# EasyEDA Pro project 初版天猛星拓展板_2026-07-21.epro

# Schematic Schematic1
Assembly Variant: Basic; Board Name: Board1; Create Date: 2026-07-18; Page Name: P1; Project Name: 天猛星拓展板; Schematic Name: Schematic1; Update Date: 2026-07-18; BladeWidth: 10; Company: 嘉立创EDA; Page Size: A4; RegionStart: 1; ShowBorder: 1; TitleBlock: 1; TitleBlockPosition: 3; Version: V1.0; XRegionCount: 6; YRegionCount: 4
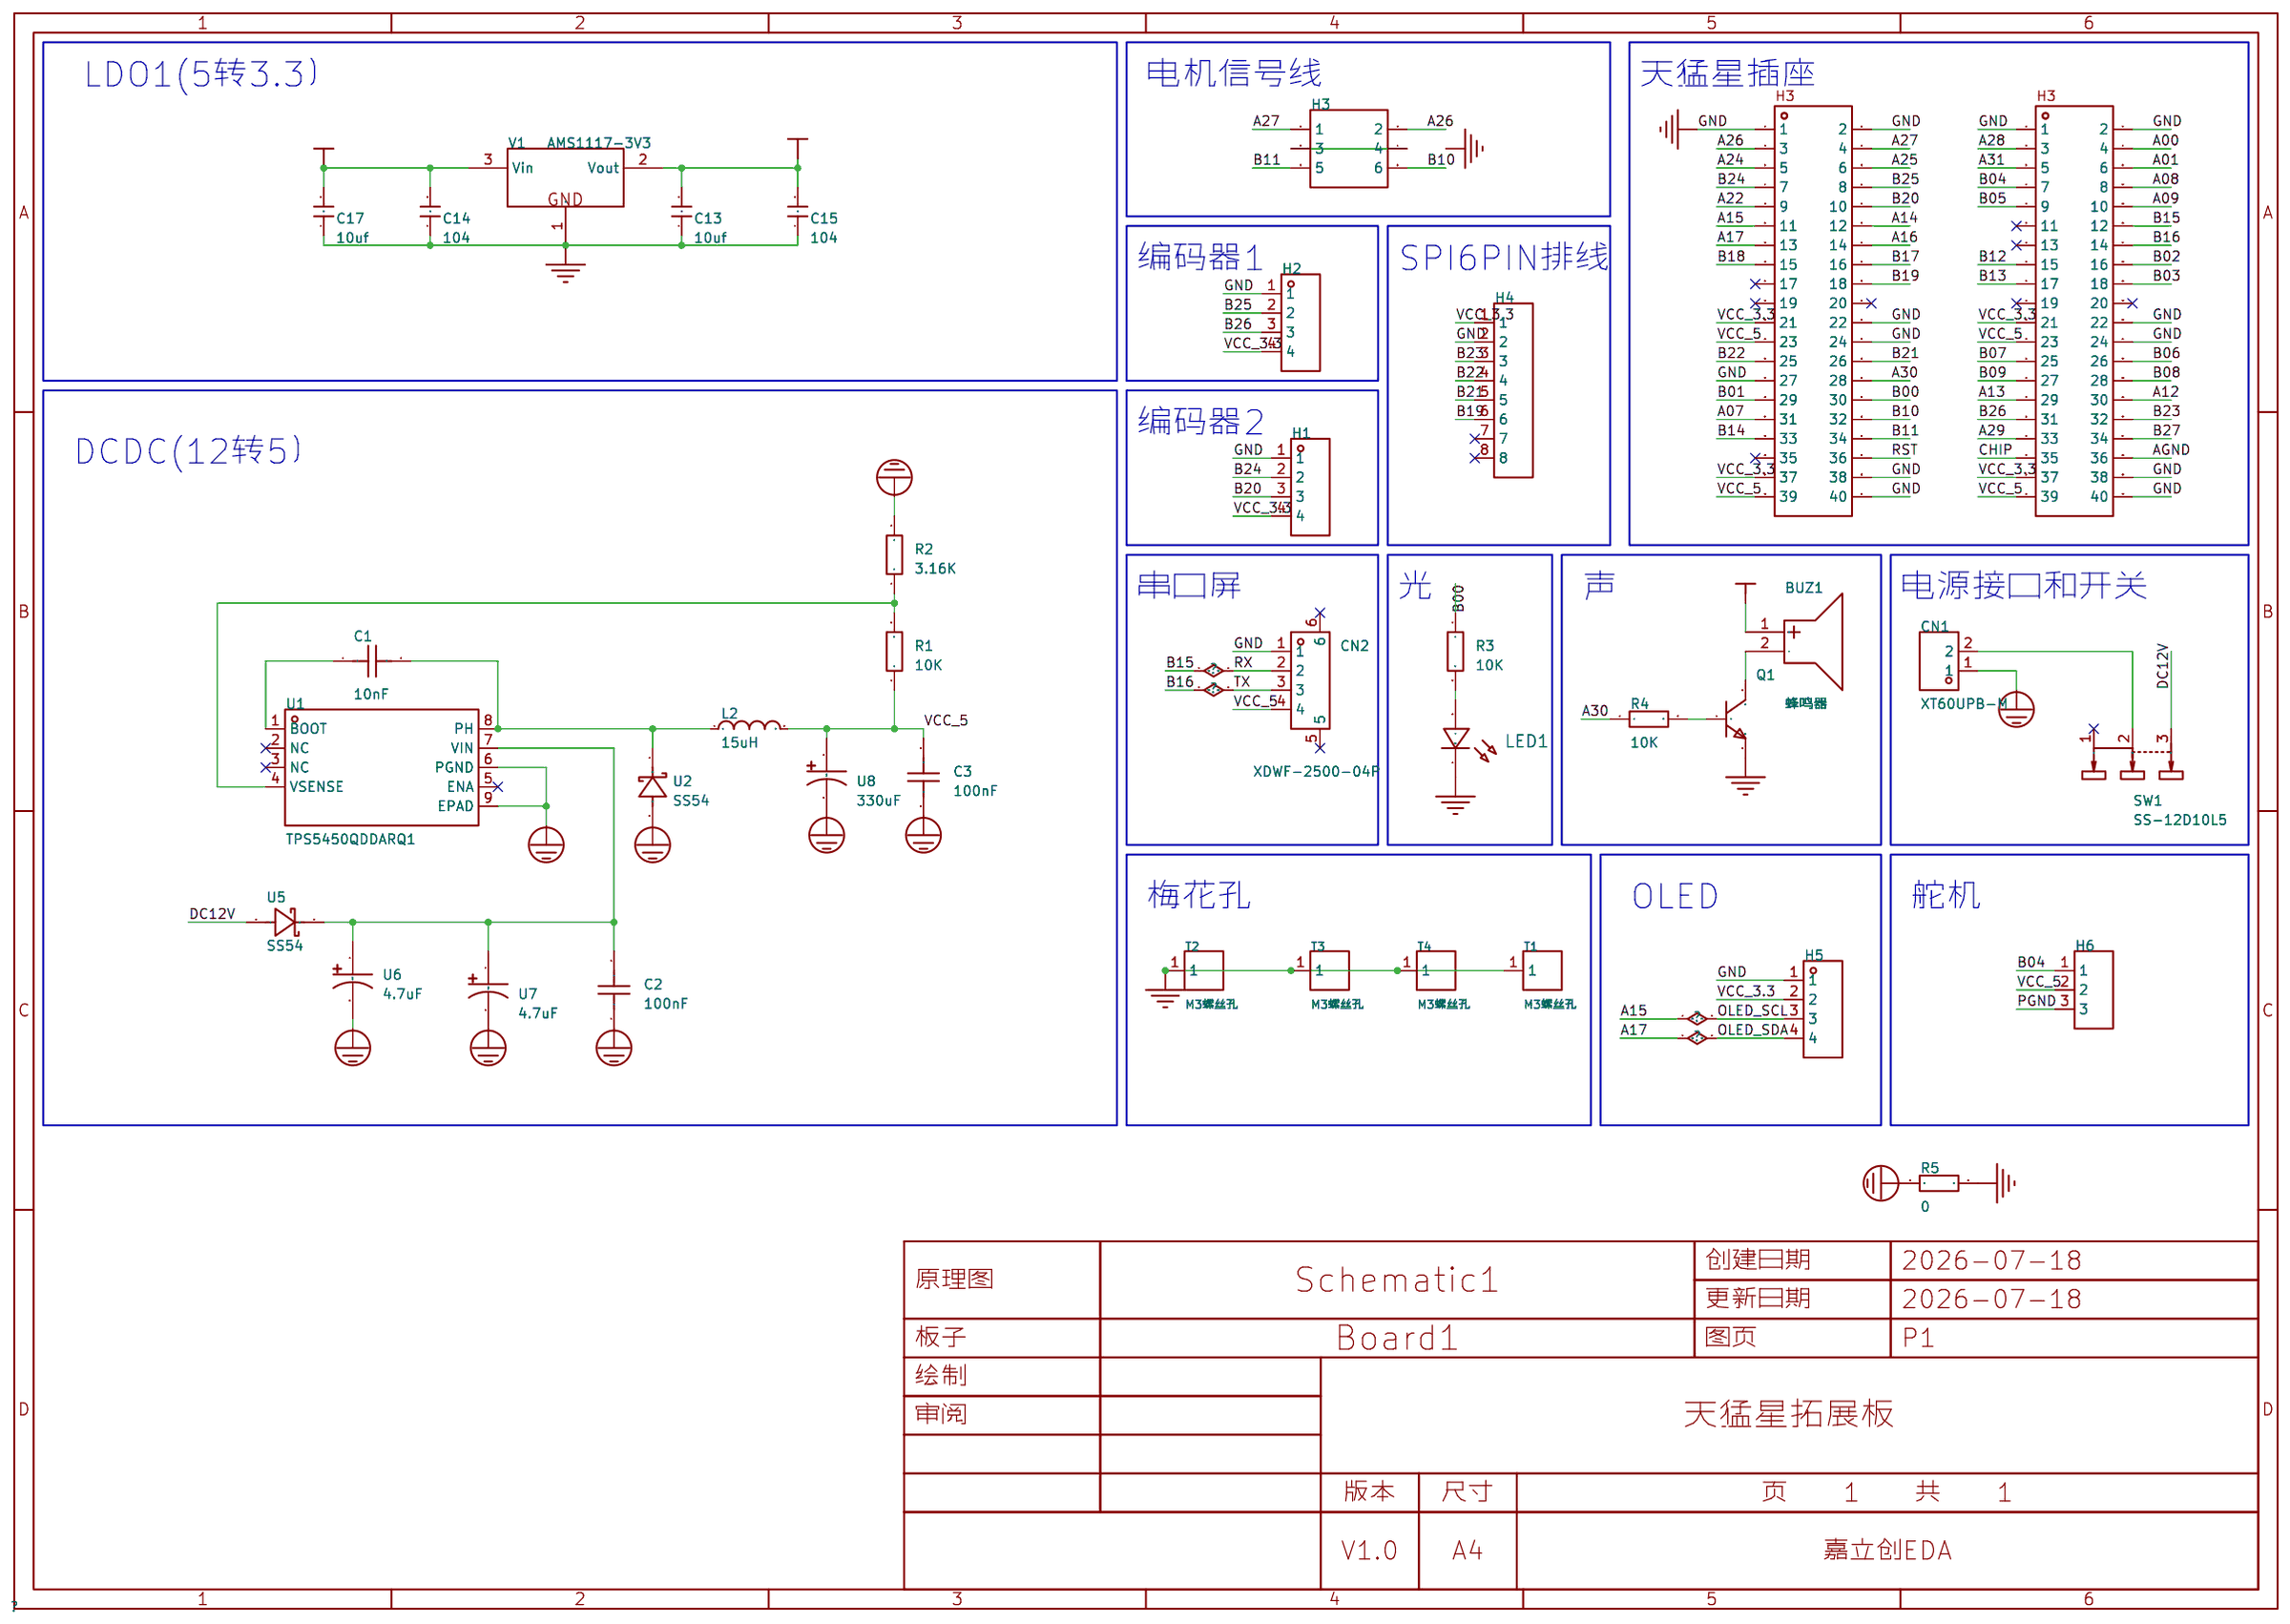
[diagram p0: schematic sheet]

## Parts
BUZ1  蜂鸣器  [BUZ-TH_BD9.0-P5.00-D0.6-FD]
C1  10nF  [C0603]
C2  100nF  [C0603]
C3  100nF  [C0603]
C13  10uf  [C 0805_M]
C14  104  [C 0603_M]
C15  104  [C 0603_M]
C17  10uf  [C 0805_M]
CN1  XT60UPB-M  [CONN-TH_XT60UPB-M]
CN2  XDWF-2500-04P  [CONN-SMD_4P-P2.54_MXXH-2.54-04P-WT1-0-A]
H1  -  [HDR-TH_4P-P2.54-V-F]
H2  -  [HDR-TH_4P-P2.54-V-F]
H3  -  [HDR-TH_6P-P2.54-V-R2-C3-S2.54_A2541WV-2X3P]
H4  -  [HDR-TH_8P-P2.54-V-F-1]
H5  -  [HDR-TH_4P-P2.54-V-F]
H6  -  [HDR-TH_3P-P2.54-V-F]
L2  15uH  [IND-SMD_L7.3-W6.6]
LED1  -  [LED_0603]
Q1  -  [S8050_SOT-23]
R1  10K  [R0603]
R2  3.16K  [R0603]
R3  10K  [R0603]
R4  10K  [R0603]
R5  0  [R0603]
SW1  SS-12D10L5  [SW-TH_SS-12D10L5]
T1  M3螺丝孔  [M3梅花孔]
T2  M3螺丝孔  [M3梅花孔]
T3  M3螺丝孔  [M3梅花孔]
T4  M3螺丝孔  [M3梅花孔]
U1  TPS5450QDDARQ1  [SOIC-8_L4.9-W3.9-P1.27-LS6.0-BL-EP]
U2  SS54  [SMA_L4.2-W2.6-LS5.1-RD]
U3  -  [HDR-TH_40P-P2.54-V-F-R2-C20-S2.54]
U4  -  [HDR-TH_40P-P2.54-V-F-R2-C20-S2.54]
U5  SS54  [SMA_L4.2-W2.6-LS5.1-RD]
U6  4.7uF  [CAP-SMD_BD5.0-L5.3-W5.3-FD]
U7  4.7uF  [CAP-SMD_BD5.0-L5.3-W5.3-FD]
U8  330uF  [CAP-SMD_BD5.0-L5.3-W5.3-FD]
V1  AMS1117-3V3  [SOT223_L]

## Library data of the parts
BUZ1 = 蜂鸣器: Supplier Part: C9900020875; Supplier Footprint: 插件; JLCPCB Part Class: Extended Part; Supplier: LCSC
C1-C3 = CAP_0603: Supplier Footprint: 0603
C13 C17 = 10uf: 无极性贴片电容; BOM名称: 无极性贴片电容; 版权归属: 源创客; 学习资源: www.ooocke.com; Origin Footprint 2: C 0201; Origin Footprint 3: C 0402; Origin Footprint 4: C 0603; Origin Footprint 5: C 1206; Origin Footprint 6: C 1210; Origin Footprint 7: C 1808; Origin Footprint 8: C 1812; Origin Footprint 9: C 1825; Origin Footprint 10: C 2225; Design Item ID: C; Library Name: 电阻-电容-电感
C14 C15 = 104: 无极性贴片电容; BOM名称: 无极性贴片电容; 版权归属: 源创客; 学习资源: www.ooocke.com; Origin Footprint 2: C 0201; Origin Footprint 3: C 0402; Origin Footprint 4: C 0805_M; Origin Footprint 5: C 1206; Origin Footprint 6: C 1210; Origin Footprint 7: C 1808; Origin Footprint 8: C 1812; Origin Footprint 9: C 1825; Origin Footprint 10: C 2225; Design Item ID: C; Library Name: 电阻-电容-电感
CN1 = XT60UPB-M: Supplier Part: C2918078; Supplier Footprint: 插件; JLCPCB Part Class: Extended Part; Supplier: LCSC
CN2 = XDWF-2500-04P: 插针结构:1x4P;间距:2.54mm;安装方式:卧贴;参考系列:XH;总PIN数:4P;排数:1;每排PIN数:4;额定电流:4A;触头材质:黄铜;工作温度:-40℃~+85℃;; LCSC Part Name: 1x4P 间距:2.54mm 卧贴 系列:XH; Supplier Part: C19723931; Manufacturer: LX(连欣科技); Supplier Footprint: SMD,P=2.5mm,卧贴; JLCPCB Part Class: Extended Part; Datasheet: https://item.szlcsc.com/datasheet/XDWF-2500-04P/21042237.html; Supplier: LCSC; Pins Structure: 1x4P; Pitch: 2.54mm; Mounting Type: 卧贴; Reference Series: XH; Number of Pins: 4P; Number of Rows: 1; Number of PINs Per Row: 4; Current Rating: 4A; Contact Material: 黄铜; Operating Temperature: -40℃~+85℃; Voltage Rating: 250V; Plastic Material: LCP; Color: 米色; Z-Height of the Board: 6mm; Y-Width of Bottom Edge on Board: 11.6mm
H1 H2 H5 = HDR-F_2.54_1x4P: Supplier Part: C2718488; Supplier Footprint: 插件
H3 = HDR-M_2.54_2x3: Supplier Part: C402781; Supplier Footprint: 插件,P=2.54mm
H4 = HDR-F_2.54_1x8P: Supplier Part: C27438; Supplier Footprint: 插件
H6 = HDR-F_2.54_1x3P: Supplier Part: C541850; Supplier Footprint: 插件
L2 = 150uH_INDU-7mm: Supplier Part: C9900019548; JLCPCB Part Class: Extended Part; Supplier: LCSC
LED1 = LED_0603-R: Supplier Footprint: 0603
Q1 = S8050_SOT_NPN: Supplier Footprint: SOT-23
R1-R5 = Res_0603: Supplier Footprint: 0603
SW1 = SS-12D10L5: 电路结构:单刀双掷;安装方式:直插;开关颜色:黑色;额定电流:3A;额定电压:125V;工作寿命:1万次;; LCSC Part Name: 柄长5mm 直插双档 滑动开关; Supplier Part: C319012; Manufacturer: XKB Connection(中国星坤); Supplier Footprint: 插件,13x6.8mm; JLCPCB Part Class: 扩展库; Datasheet: https://item.szlcsc.com/datasheet/SS-12D10L5/300104.html; Supplier: LCSC; Circuit: 单刀双掷; Actuator Style: 矩形柱状; Termination Style: PC引脚; Length: 13mm; Width: 6.8mm; Switch Height: 6.4mm; Mounting Type: 直插; Actuator Color: 黑色; Current Rating: 3A; Voltage Rating: 125V; Life: 1万次; Operating Temperature: -40℃~+85℃
T1-T4 = M3螺丝孔
U1 = TPS5450QDDARQ1: 功能类型:降压型;工作电压:5.5V~36V;输出电压:1.221V~32.04V;输出电流:5A;输出类型:可调;; LCSC Part Name: 降压型 5A 5.5V~36V; Supplier Part: C181270; Manufacturer: TI(德州仪器); Supplier Footprint: SOIC-8-EP; JLCPCB Part Class: Extended Part; Datasheet: https://www.ti.com/cn/lit/gpn/tps5450-q1; Supplier: LCSC; Function: 降压型; Voltage - Supply: 5.5V~36V; Output Voltage: 1.221V~32.04V; Output Current: 5A; Frequency - Switching: 500kHz; Operating Temperature: -40℃~+125℃@(TJ); Synchronous Rectifier: 否; Number of Outputs: 1; Topology: 降压式; Quiescent Current: 3mA; Switch tube (built-in/external): 内置; Output Type: 可调; Features: 逐波限流；过流保护；打嗝限流
U2 U5 = SS54: Supplier Part: C9900023219; Supplier Footprint: (1N5824)DO-214; JLCPCB Part Class: Extended Part; Supplier: LCSC
U3 U4 = HDR-M_2.54_2x20: Supplier Part: C132132; Supplier Footprint: 插件
U6-U8 = CMC(5*5.4)-33U/25V: Supplier Part: C9900001469; Supplier Footprint: CAP-SMD_BD5.0-L5.3-W5.3; JLCPCB Part Class: Extended Part; Supplier: LCSC
V1 = AMS1117-3V3: 三端稳压芯片; BOM名称: 稳压芯片; 版权归属: 源创客; 学习资源: www.ooocke.com; Origin Footprint 2: SOT223_M; Origin Footprint 3: SOT223_N; Origin Footprint 4: SOT89_L; Origin Footprint 5: SOT89_N; Origin Footprint 6: SOT89_M; Design Item ID: AMS1117; Library Name: IC芯片

## Nets
AGND: U4.36
GND: C13.1 C14.1 C15.1 C17.1 CN2.1 H1.1 H2.1 H3.3 H3.4 H4.2 H5.1 LED1.1(C) Q1.2 R5.2 T1.1 T2.1 T3.1 T4.1 U3.1 U3.2 U3.22 U3.24 U3.27 U3.38 U3.40 U4.1 U4.2 U4.22 U4.24 U4.38 U4.40 V1.1(GND)
PGND: C2.1 C3.1 CN1.1 H6.3 R2.2 R5.1 U1.6(PGND) U1.9(EPAD) U2.2(A) U6.2 U7.2 U8.2
VCC_3.3: BUZ1.1(+) C13.2 C15.2 H1.4 H2.4 H4.1 H5.2 U3.21 U3.37 U4.21 U4.37 V1.2(Vout)
VCC_5: C3.2 C14.2 C17.2 CN2.4 H6.2 L2.2 R1.1 U3.23 U3.39 U4.23 U4.39 U8.1 V1.3(Vin)
A00: U4.4
A01: U4.6
A07: U3.31
A08: U4.8
A09: U4.10
A12: U4.30
A13: U4.29
A14: U3.12
A15: H5.3 U3.11
A16: U3.14
A17: H5.4 U3.13
A22: U3.9
A24: U3.5
A25: U3.6
A26: H3.2 U3.3
A27: H3.1 U3.4
A28: U4.3
A29: U4.33
A30: R4.1 U3.28
A31: U4.5
B00: R3.1 U3.30
B01: U3.29
B02: U4.16
B03: U4.18
B04: H6.1 U4.7
B05: U4.9
B06: U4.26
B07: U4.25
B08: U4.28
B09: U4.27
B10: H3.6 U3.32
B11: H3.5 U3.34
B12: U4.15
B13: U4.17
B14: U3.33
B15: CN2.2 U4.12
B16: CN2.3 U4.14
B17: U3.16
B18: U3.15
B19: H4.6 U3.18
B20: H1.3 U3.10
B21: H4.5 U3.26
B22: H4.4 U3.25
B23: H4.3 U4.32
B24: H1.2 U3.7
B25: H2.2 U3.8
B26: H2.3 U4.31
B27: U4.34
CHIP: U4.35
DC12V: SW1.3 U5.2(A)
RST: U3.36
$1N263: C1.2 L2.1 U1.8(PH) U2.1(C)
$1N264: C1.1 U1.1(BOOT)
$1N267: C2.2 U1.7(VIN) U5.1(C) U6.1 U7.1
$1N278: R1.2 R2.1 U1.4(VSENSE)
$1N286: LED1.2(A) R3.2
$1N289: Q1.1 R4.2
$1N292: BUZ1.2(-) Q1.3
$1N298: CN1.2 SW1.2

Not connected (* = marked no-connect by the designer): CN2 5* 6*; H4 7* 8*; SW1 1*; U1 2(NC)* 3(NC)* 5(ENA)*; U3 17* 19* 20* 35*; U4 11* 13* 19* 20*

## Notes on the sheet
- LDO1(5转3.3）
- 电机信号线
- 天猛星插座
- 编码器1
- SPI6PIN排线
- 编码器2
- DCDC(12转5）
- 串口屏
- 光
- 声
- 电源接口和开关
- 梅花孔
- OLED
- 舵机

# Board PCB1
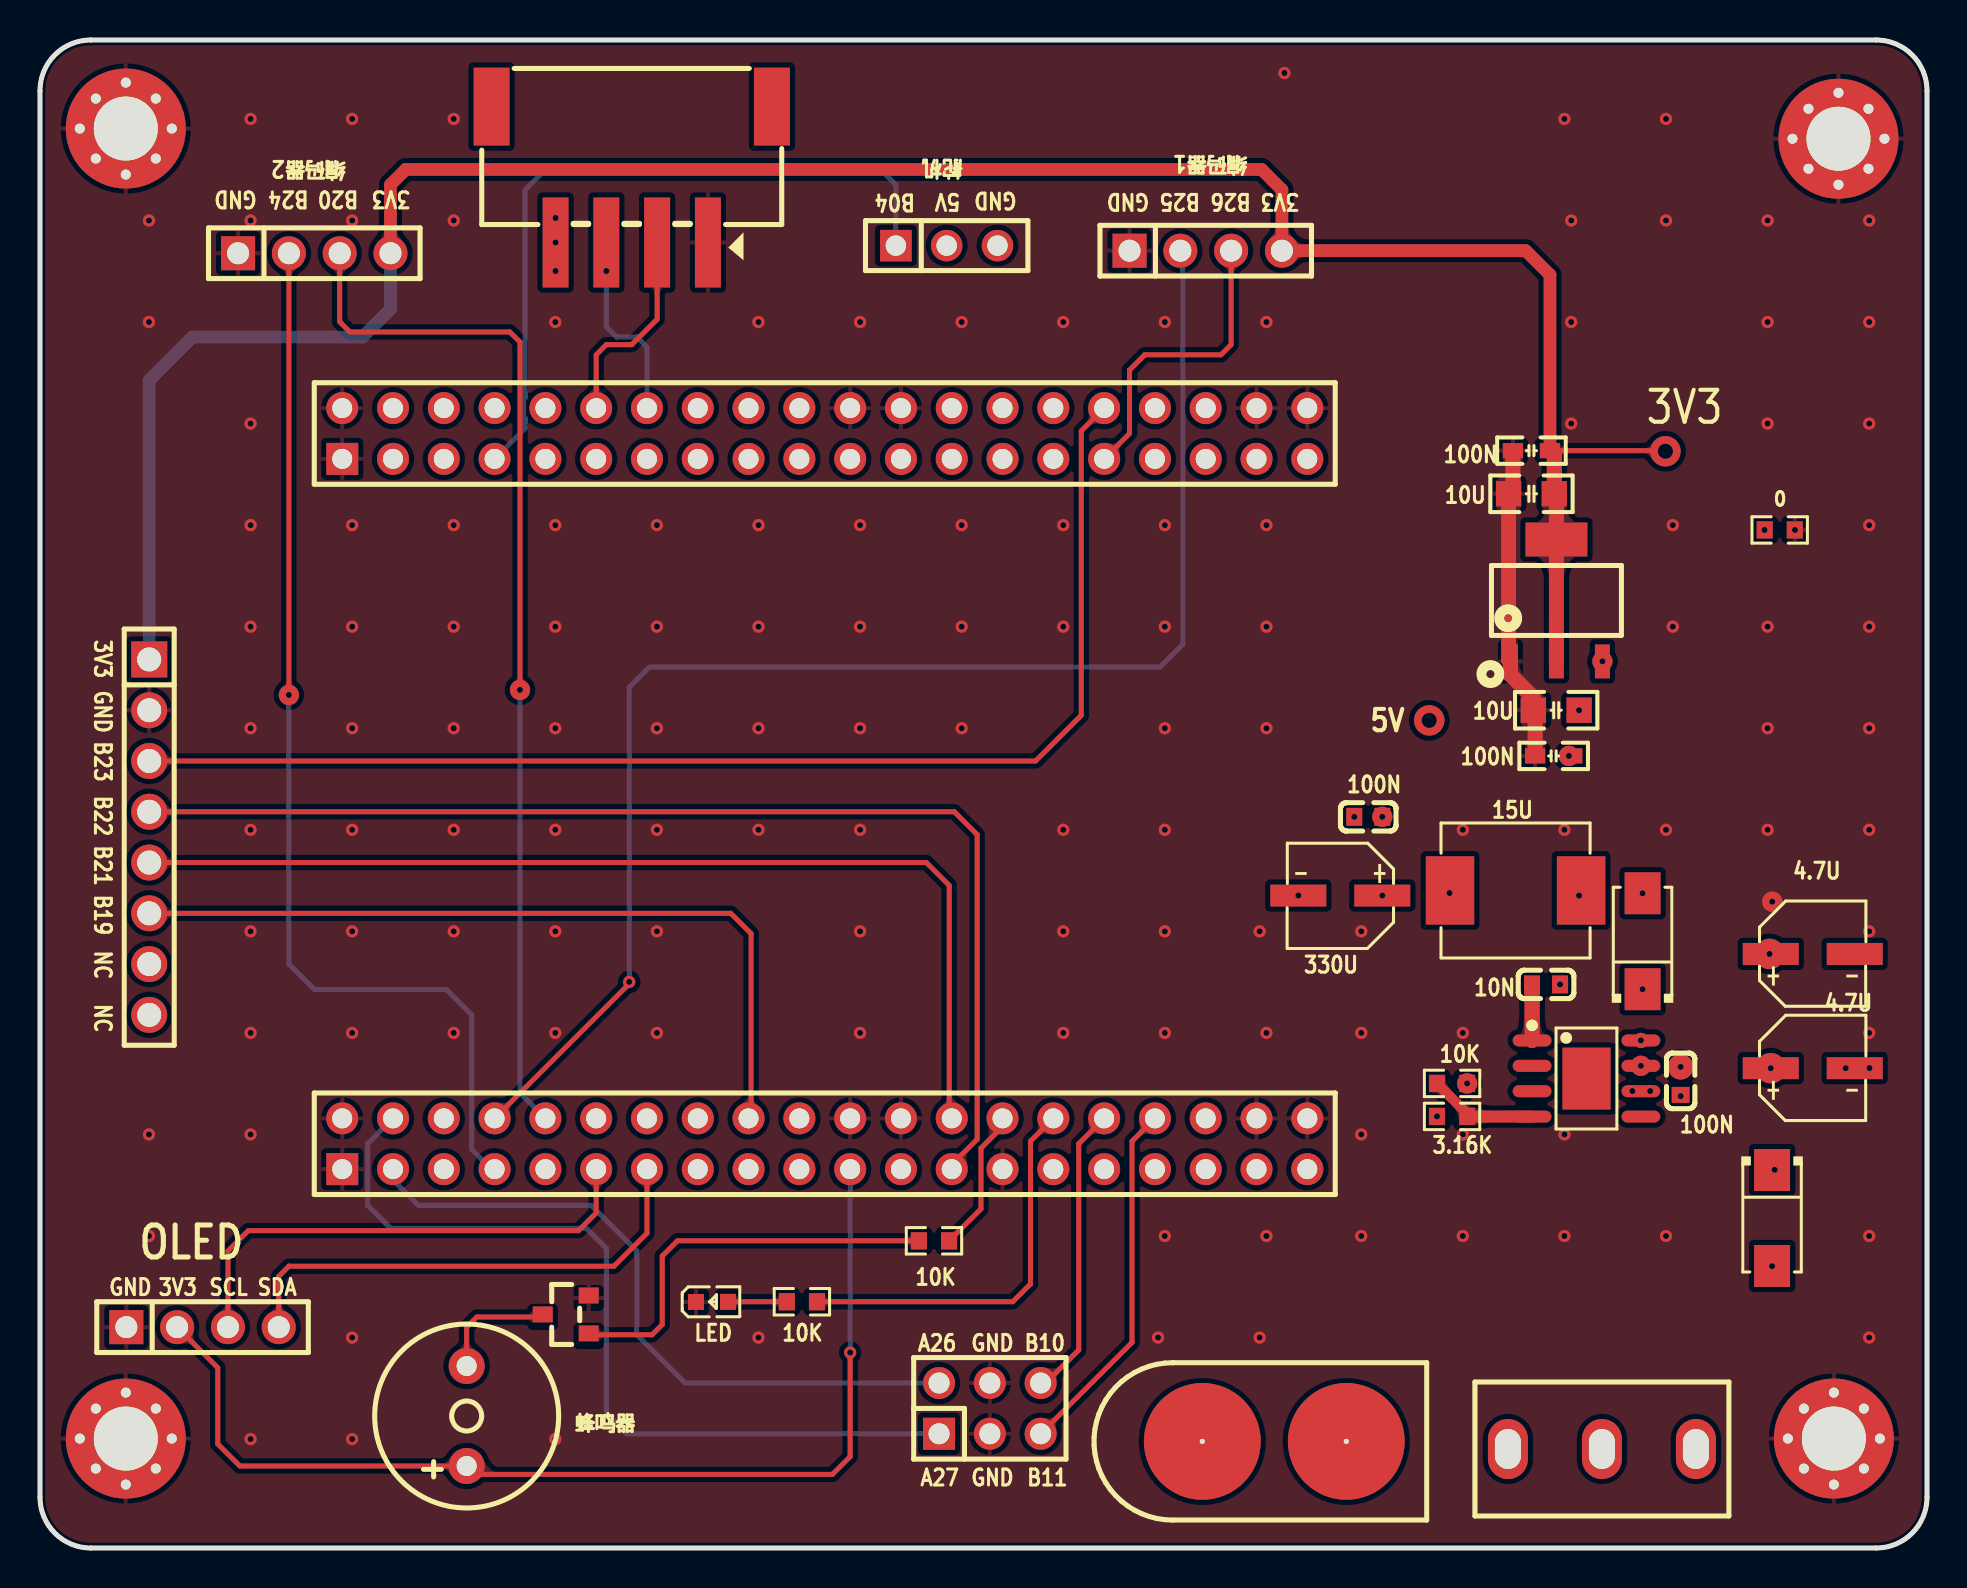
[diagram p1: board, top side]
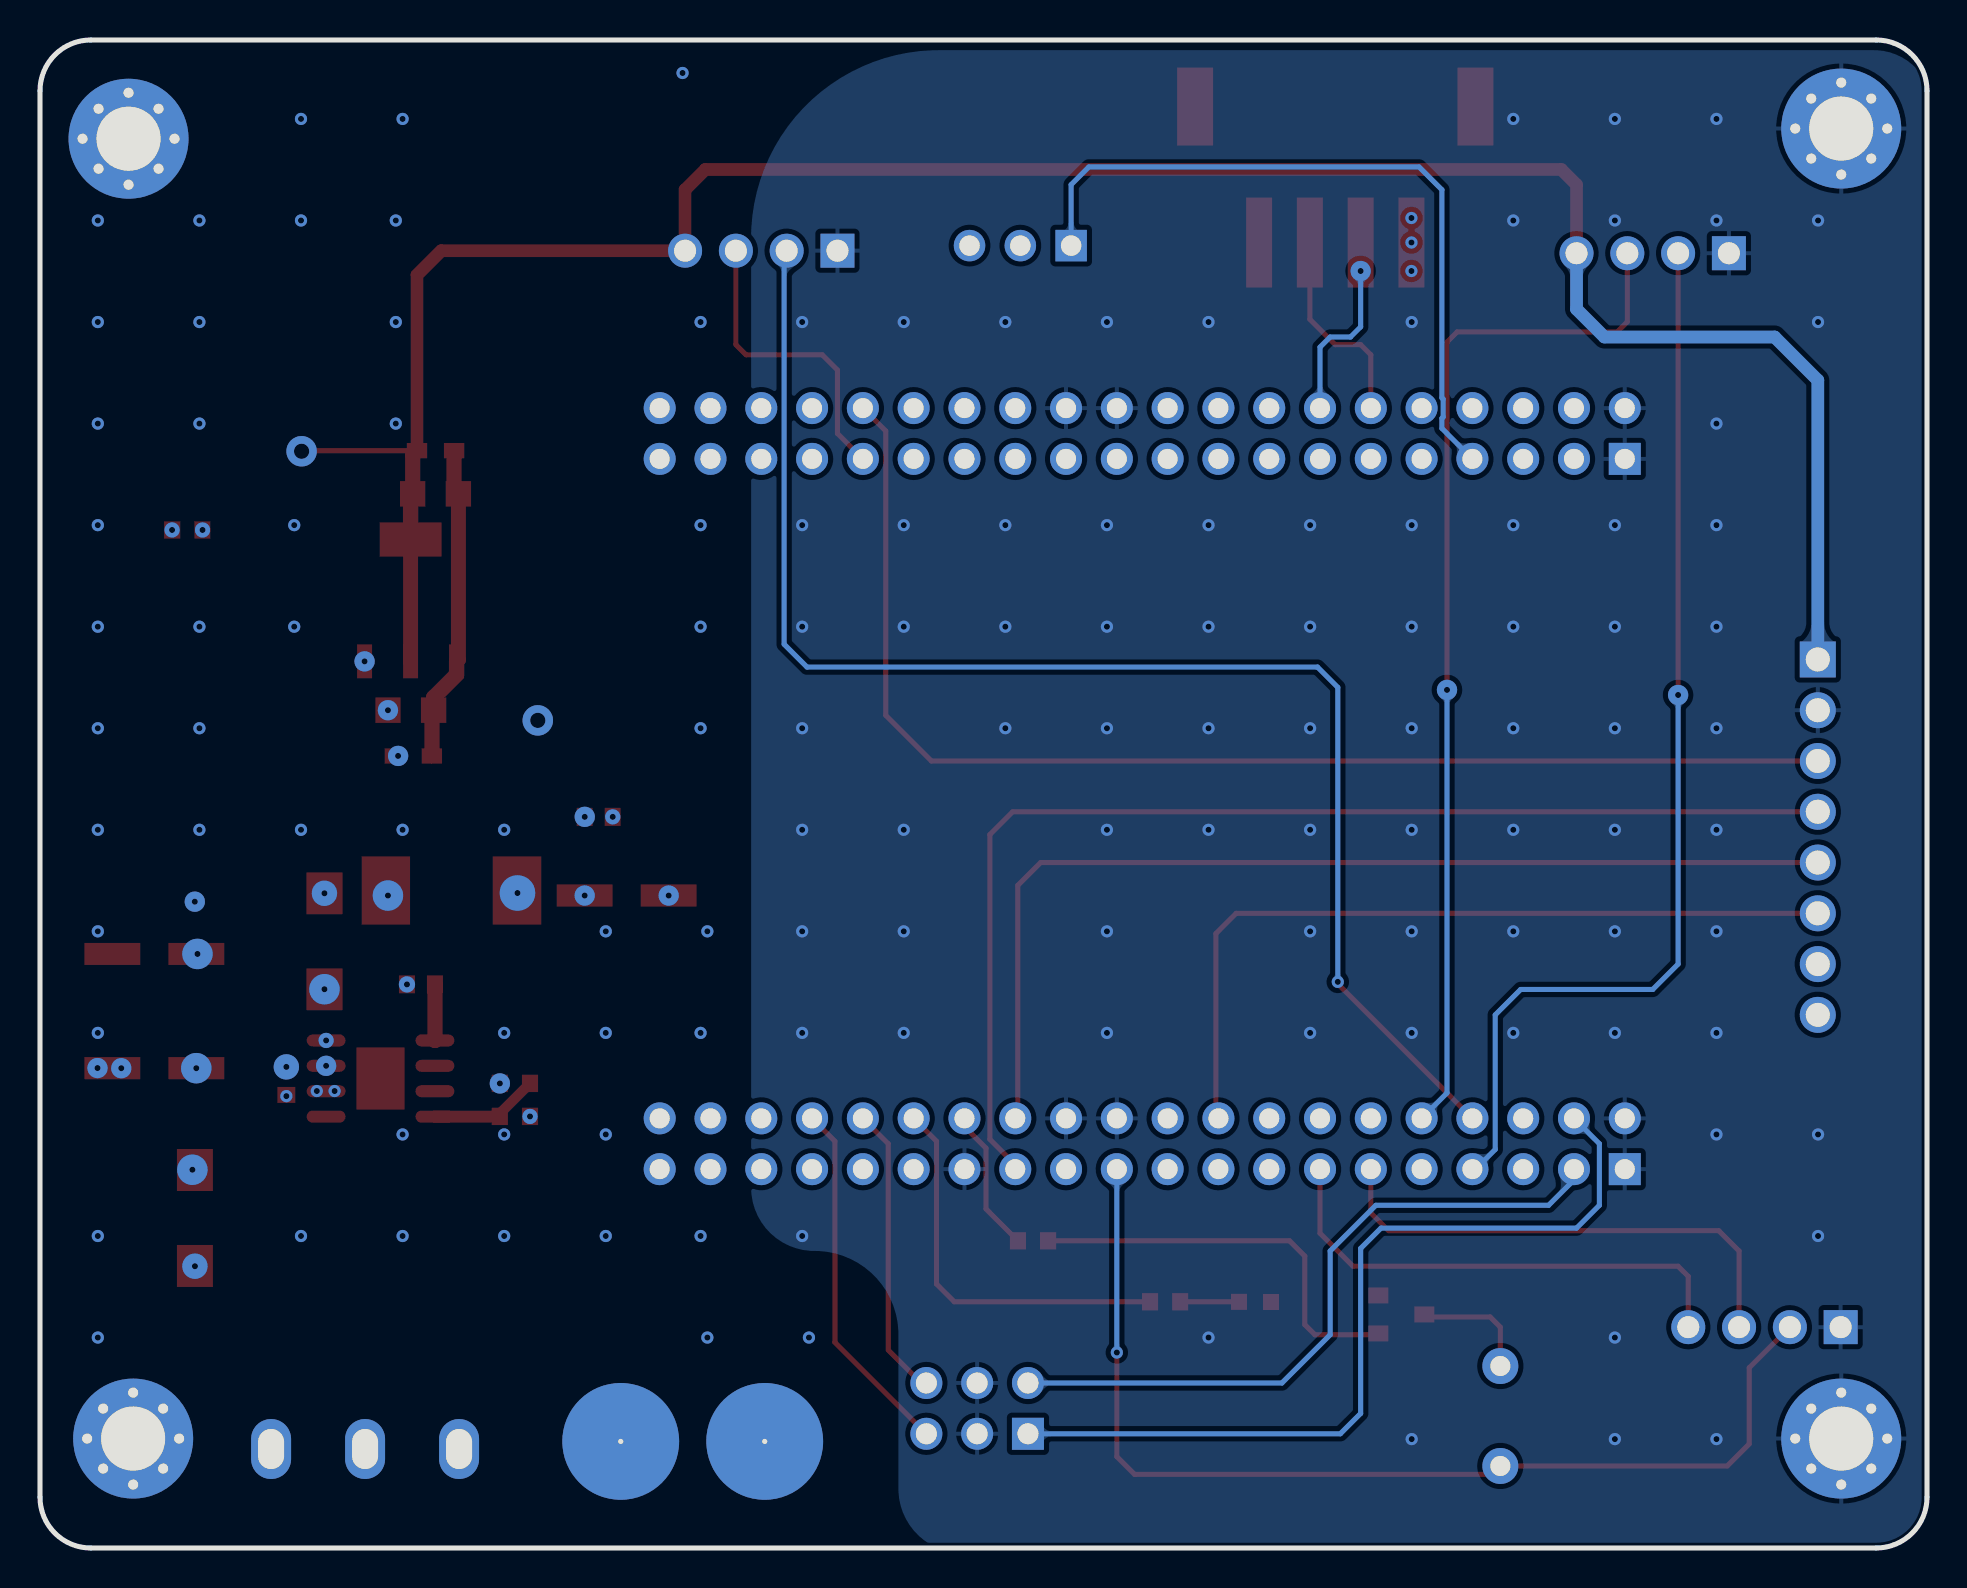
[diagram p2: board, bottom side, seen from below]

Outline 94.36 x 75.44 mm; copper layers: Top Layer, Inner1, Inner2, Bottom Layer. Coordinates in mm from the lower left corner of the outline.
Outline path: 0,72.9 0,2.54 arc(0.74,0.74) 2.54,0 91.82,0 arc(93.62,0.74) 94.36,2.54 94.36,72.9 arc(93.62,74.69) 91.82,75.44 2.54,75.44 arc(0.74,74.69) 0,72.9
Stack: Top Layer 0.035mm Outer layer thickness 1oz / Dielectric1 0.2104mm 7628 RC49% 8.6mil / Inner1 0.0152mm Inner layer thickness / Dielectric2 1.065mm 1.1mm H/HOZ Copper / Inner2 0.0152mm Inner layer thickness / Dielectric3 0.2104mm 7628 RC49% 8.6mil / Bottom Layer 0.035mm Outer layer thickness 1oz

## Design rules (mm)
spacing copperThickness1oz (default): track to track 0.102, other pairs 0.152 to 0.3
spacing copperThickness2oz: track to track 0.203, other pairs 0.152 to 0.3
track width copperThickness1oz (default): min 0.127, default 0.254, max 2.54
track width copperThickness2oz: min 0.203, default 0.254, max 2.54
differential pair differentialPair (default): width min 0.127, default 0.254, max 2.54; gap min 0.152, default 0.152
net $1N298 uses copperRegion
net DC12V uses copperRegion
net $1N263 uses copperRegion
net $1N267 uses copperRegion
net VCC_5 uses copperRegion
net GND uses copperRegion
net PGND uses copperRegion

## Placement (name value [footprint] x y rotation side)
0  0  [R0603]  87 50.93 0 top
BUZ1  蜂鸣器  [BUZ-TH_BD9.0-P5.00-D0.6-FD]  21.34 6.6 90 top
C1  10nF  [C0603]  75.31 28.19 0 top
C2  100nF  [C0603]  82.04 23.37 90 top
C3  100nF  [C0603]  66.42 36.58 0 top
C13  10uf  [C 0805_M]  74.58 52.74 0 top
C14  104  [C 0603_M]  75.69 39.62 0 top
C15  104  [C 0603_M]  74.58 54.9 0 top
C17  10uf  [C 0805_M]  75.82 41.91 0 top
CN1  XT60UPB-M  [CONN-TH_XT60UPB-M]  61.72 5.33 0 top
CN2  XDWF-2500-04P  [CONN-SMD_4P-P2.54_MXXH-2.54-04P-WT1-0-A]  29.59 68.71 180 top
H1  -  [HDR-TH_4P-P2.54-V-F]  13.72 64.77 0 top
H2  -  [HDR-TH_4P-P2.54-V-F]  58.29 64.9 0 top
H3  -  [HDR-TH_6P-P2.54-V-R2-C3-S2.54_A2541WV-2X3P]  47.5 6.99 0 top
H4  -  [HDR-TH_8P-P2.54-V-F-1]  5.46 35.56 270 top
H5  -  [HDR-TH_4P-P2.54-V-F]  8.13 11.05 0 top
H6  -  [HDR-TH_3P-P2.54-V-F]  45.34 65.15 0 top
L2  15uH  [IND-SMD_L7.3-W6.6]  73.79 32.89 0 top
LED1  -  [LED_0603]  33.66 12.32 0 top
Q1  -  [S8050_SOT-23]  26.29 11.56 0 top
R1  10K  [R0603]  70.61 23.24 180 top
R2  3.16K  [R0603]  70.61 21.59 180 top
R3  10K  [R0603]  38.1 12.32 180 top
R4  10K  [R0603]  44.7 15.37 180 top
SW1  SS-12D10L5  [SW-TH_SS-12D10L5]  78.1 4.95 0 top
T1  M3螺丝孔  [M3梅花孔]  89.7 5.47 0 top
T2  M3螺丝孔  [M3梅花孔]  4.29 71.01 0 top
T3  M3螺丝孔  [M3梅花孔]  4.29 5.47 0 top
T4  M3螺丝孔  [M3梅花孔]  89.93 70.5 0 top
U1  TPS5450QDDARQ1  [SOIC-8_L4.9-W3.9-P1.27-LS6.0-BL-EP]  77.33 23.49 270 top
U2  SS54  [SMA_L4.2-W2.6-LS5.1-RD]  80.14 30.35 90 top
U3  -  [HDR-TH_40P-P2.54-V-F-R2-C20-S2.54]  39.24 20.22 0 top
U4  -  [HDR-TH_40P-P2.54-V-F-R2-C20-S2.54]  39.24 55.75 0 top
U5  SS54  [SMA_L4.2-W2.6-LS5.1-RD]  86.61 16.51 270 top
U6  4.7uF  [CAP-SMD_BD5.0-L5.3-W5.3-FD]  88.65 29.72 0 top
U7  4.7uF  [CAP-SMD_BD5.0-L5.3-W5.3-FD]  88.65 24 0 top
U8  330uF  [CAP-SMD_BD5.0-L5.3-W5.3-FD]  65.02 32.64 180 top
V1  AMS1117-3V3  [SOT223_L]  75.83 47.4 0 top

## Footprints (pads in the part's own frame, mm; a bottom-side part is the same pattern mirrored in y, then rotated)
BUZ-TH_BD9.0-P5.00-D0.6-FD
  round 1.8 hole 1: 1(-2.5,0) 2(2.5,0)
C0603
  rect 0.8x0.9 smd: 1(-0.7,0) 2(0.7,0)
C 0603_M
  rect 1.016x0.762 smd: 1(-0.927,0) 2(0.927,0)
C 0805_M
  rect 1.27x1.27 smd: 1(-1.143,0) 2(1.143,0)
CAP-SMD_BD5.0-L5.3-W5.3-FD
  rect 2.8x1.1 smd: 1(-2.1,0) 2(2.1,0)
CONN-SMD_4P-P2.54_MXXH-2.54-04P-WT1-0-A
  rect 1.3x4.5 smd: 1(-3.809,3.4) 2(-1.27,3.4) 3(1.27,3.4) 4(3.81,3.4)
  rect 1.8x3.9 smd: 5(7.01,-3.4) 6(-7.01,-3.4)
CONN-TH_XT60UPB-M
  round 5.842 hole 0.254: 1(-3.6,0) 2(3.6,0)
HDR-TH_3P-P2.54-V-F
  rect 1.575x1.575 hole 1.02: 1(-2.54,0)
  round 1.575 hole 1.02: 2(0,0) 3(2.54,0)
HDR-TH_4P-P2.54-V-F
  rect 1.7x1.7 hole 1.1: 1(-3.81,0)
  round 1.7 hole 1.1: 2(-1.27,0) 3(1.27,0) 4(3.81,0)
HDR-TH_6P-P2.54-V-R2-C3-S2.54_A2541WV-2X3P
  rect 1.6x1.6 hole 1.05: 1(-2.54,-1.27)
  round 1.6 hole 1.05: 2(-2.54,1.27) 3(0,-1.27) 4(0,1.27) 5(2.54,-1.27) 6(2.54,1.27)
HDR-TH_8P-P2.54-V-F-1
  rect 1.8x1.8 hole 1.2: 1(-8.89,0)
  round 1.8 hole 1.2: 2(-6.35,0) 3(-3.81,0) 4(-1.27,0) 5(1.27,0) 6(3.81,0) 7(6.35,0) 8(8.89,0)
HDR-TH_40P-P2.54-V-F-R2-C20-S2.54
  rect 1.6x1.6 hole 1: 1(-24.13,-1.27)
  round 1.6 hole 1: 2(-24.13,1.27) 3(-21.59,-1.27) 4(-21.59,1.27) 5(-19.05,-1.27) 6(-19.05,1.27) 7(-16.51,-1.27) 8(-16.51,1.27) 9(-13.97,-1.27) 10(-13.97,1.27) 11(-11.43,-1.27) 12(-11.43,1.27) 13(-8.89,-1.27) 14(-8.89,1.27) 15(-6.35,-1.27) 16(-6.35,1.27) 17(-3.81,-1.27) 18(-3.81,1.27) 19(-1.27,-1.27) 20(-1.27,1.27) 21(1.27,-1.27) 22(1.27,1.27) 23(3.81,-1.27) 24(3.81,1.27) 25(6.35,-1.27) 26(6.35,1.27) 27(8.89,-1.27) 28(8.89,1.27) 29(11.43,-1.27) 30(11.43,1.27) 31(13.97,-1.27) 32(13.97,1.27) 33(16.51,-1.27) 34(16.51,1.27) 35(19.05,-1.27) 36(19.05,1.27) 37(21.59,-1.27) 38(21.59,1.27) 39(24.13,-1.27) 40(24.13,1.27)
IND-SMD_L7.3-W6.6
  rect 2.424x3.42 smd: 1(3.278,0) 2(-3.278,0)
LED_0603
  rect 0.8x0.8 smd: 1(-0.851,-0.01) 2(0.75,-0.005)
M3梅花孔
  round 1 hole 0.5: 1(-2.3,0) 1(-1.5,1.5) 1(-1.5,-1.5) 1(0,2.3) 1(0,-2.3) 1(1.5,1.5) 1(1.5,-1.5) 1(2.3,0)
  round 6 hole 3.2: 1(0,0)
R0603
  rect 0.806x0.864 smd: 1(-0.753,0) 2(0.753,0)
S8050_SOT-23
  rect 1x0.8 smd: 1(1.15,-0.823) 2(1.15,1.077) 3(-1.15,0.127)
SMA_L4.2-W2.6-LS5.1-RD
  rect 2.1x1.8 smd: 1(-2.4,0) 2(2.4,0)
SOIC-8_L4.9-W3.9-P1.27-LS6.0-BL-EP
  oval 0.602x1.941 smd: 1(-1.905,-2.72) 2(-0.635,-2.72) 3(0.635,-2.72) 4(1.905,-2.72) 5(1.905,2.72) 6(0.635,2.72) 7(-0.635,2.72) 8(-1.905,2.72)
  rect 3.098x2.41 smd: 9(0,0)
SOT223_L
  rect 0.75x1.7 smd: 1(-2.3,-3.048) 2(0,-3.048) 3(2.3,-3.048)
  rect 3.1x1.7 smd: 2(0,3.048)
SW-TH_SS-12D10L5
  oval 2x3 hole 1.3x2: 1(-4.7,0) 2(0,0) 3(4.7,0)

## Nets
As in the schematic, except:
GND: 0.2 C13.1 C14.1 C15.1 C17.1 CN2.1 H1.1 H2.1 H3.3 H3.4 H4.2 H5.1 LED1.1 Q1.2 T1.1 T2.1 T3.1 T4.1 U3.1 U3.2 U3.22 U3.24 U3.27 U3.38 U3.40 U4.1 U4.2 U4.22 U4.24 U4.38 U4.40 V1.1
PGND: 0.1 C2.1 C3.1 CN1.1 H6.3 R2.2 U1.6 U1.9 U2.2 U6.2 U7.2 U8.2

Pads without a net: CN2 5 6; H4 7 8; SW1 1; U1 2 3 5; U3 17 19 20 35; U4 11 13 19 20

## Via types
v1: diameter 0.61, hole 0.305, Top Layer to Bottom Layer, 134 vias
v2: diameter 1.016, hole 0.305, Top Layer to Bottom Layer, 14 vias
v3: diameter 0.762, hole 0.305, Top Layer to Bottom Layer, 5 vias
v4: diameter 1.524, hole 0.762, Top Layer to Bottom Layer, 2 vias
v5: diameter 1.778, hole 0.305, Top Layer to Bottom Layer, 1 via
v6: diameter 0.813, hole 0.305, Top Layer to Bottom Layer, 1 via
v7: diameter 1.524, hole 0.305, Top Layer to Bottom Layer, 5 vias
v8: diameter 1.27, hole 0.305, Top Layer to Bottom Layer, 3 vias

## Routing (per net, layer and track width the routed paths; a pad name or vN(x,y) marks a point on that pad's centre or on a via; arc(x,y) is an arc through that point)
GND: length 15.9
  Top Layer w0.75: C13.1 73.44,44.45 V1.1
  Top Layer w0.762: C13.1 73.65,52.95 C15.1 ; V1.1 73.53,43.69 74.68,42.55 C17.1 74.76,41.82 C14.1
  vias: v1(5.45,66.41) v1(5.45,61.33) v1(5.45,20.69) v1(5.45,15.61) v1(10.53,71.49) v1(10.53,66.41) v1(10.53,56.25) v1(10.53,51.17) v1(10.53,46.09) v1(10.53,41.01) v1(10.53,35.93) v1(10.53,30.85) v1(10.53,25.77) v1(10.53,20.69) v1(10.53,5.45) v1(15.61,71.49) v1(15.61,66.41) v1(15.61,51.17) v1(15.61,46.09) v1(15.61,41.01) v1(15.61,35.93) v1(15.61,30.85) v1(15.61,25.77) v1(15.61,10.53) v1(15.61,5.45) v1(20.69,71.49) v1(20.69,66.41) v1(20.69,51.17) v1(20.69,46.09) v1(20.69,41.01) v1(20.69,35.93) v1(20.69,30.85) v1(20.69,25.77) v1(25.77,61.33) v1(25.77,51.17) v1(25.77,46.09) v1(25.77,41.01) v1(25.77,35.93) v1(25.77,30.85) v1(25.77,25.77) v1(25.77,5.45) v1(30.85,51.17) v1(30.85,46.09) v1(30.85,41.01) v1(30.85,35.93) v1(30.85,30.85) v1(30.85,25.77) v1(35.93,61.33) v1(35.93,51.17) v1(35.93,46.09) v1(35.93,41.01) v1(35.93,35.93) v1(35.93,10.53) v1(41.01,61.33) v1(41.01,51.17) v1(41.01,46.09) v1(41.01,41.01) v1(41.01,35.93) v1(41.01,30.85) v1(41.01,25.77) v1(46.09,61.33) v1(46.09,51.17) v1(46.09,46.09) v1(46.09,41.01) v1(51.17,61.33) v1(51.17,51.17) v1(51.17,46.09) v1(51.17,35.93) v1(51.17,30.85) v1(51.17,25.77) v1(55.91,10.53) v1(56.25,61.33) v1(56.25,51.17) v1(56.25,46.09) v1(56.25,41.01) v1(56.25,35.93) v1(56.25,30.85) v1(56.25,25.77) v1(56.25,15.61) v1(60.99,30.85) v1(60.99,10.53) v1(61.33,61.33) v1(61.33,51.17) v1(61.33,46.09) v1(61.33,41.01) v1(61.33,25.77) v1(61.33,15.61) v1(62.23,73.79) v1(66.07,30.85) v1(66.07,25.77) v1(66.07,20.69) v1(66.07,15.61) v1(71.15,35.93) v1(71.15,25.77) v1(71.15,20.69) v1(71.15,15.61) v1(76.23,71.49) v1(76.23,35.93) v1(76.23,20.69) v1(76.23,15.61) v1(76.57,66.41) v1(76.57,61.33) v1(76.57,56.25) v1(81.31,71.49) v1(81.31,66.41) v1(81.31,35.93) v1(81.31,15.61) v1(81.65,51.17) v1(81.65,46.09) v1(86.39,66.41) v1(86.39,61.33) v1(86.39,56.25) v1(86.39,46.09) v1(86.39,41.01) v1(86.39,35.93) v1(91.47,66.41) v1(91.47,61.33) v1(91.47,56.25) v1(91.47,51.17) v1(91.47,46.09) v1(91.47,41.01) v1(91.47,35.93) v1(91.47,30.85) v1(91.47,25.77) v1(91.47,15.61) v1(91.47,10.53) v2(86.62,32.33) v3(87.76,50.93)
PGND:
  vias: v1(79.63,22.86) v1(80.52,22.86) v1(82.04,22.61) v2(62.92,32.64) v2(90.3,24) v2(91.48,24.01) v3(65.72,36.58) v3(69.86,21.59) v3(86.23,50.93) v8(80.14,32.75)
VCC_3.3: length 174.8
  Top Layer w0.254: BUZ1.1 9.99,4.1 8.89,5.21 8.89,9.02 6.86,11.05 ; v1(40.51,9.78) 40.51,4.57 39.62,3.68 21.88,3.68 21.46,4.1 ; 75.51,54.9 81.25,54.9 arc(81.27,54.89) v4(81.28,54.86)
  Top Layer w0.635: H1.4 17.53,68.2 18.29,68.96 61.09,68.96 62.1,67.95 H2.4 74.29,64.9 75.51,63.68 75.51,54.9
  Top Layer w0.75: 75.83,50.45 V1.2
  Top Layer w0.762: 75.51,54.9 75.72,54.68 C13.2 75.83,52.63 75.83,50.45
  Bottom Layer w0.254: U3.21 v1(40.51,9.78)
  Bottom Layer w0.635: H1.4 17.53,61.98 16.13,60.58 7.62,60.58 5.46,58.42 H4.1
VCC_5:
  vias: v1(25.78,66.53) v1(25.78,65.31) v1(25.78,63.88) v2(67.12,36.58) v2(67.12,32.64) v2(71.37,23.24) v2(76.45,39.62) v2(76.96,41.91) v2(78.13,44.35) v4(69.47,41.4) v5(70.48,32.77)
A15: length 25.2
  Top Layer w0.254: H5.3 9.4,14.86 10.41,15.88 26.92,15.88 27.81,16.76 U3.11
A17: length 25.1
  Top Layer w0.254: H5.4 11.94,13.59 12.45,14.1 28.7,14.1 30.35,15.75 U3.13
A26: length 34.5
  Bottom Layer w0.254: H3.2 32.26,8.25 29.84,10.67 29.84,14.86 27.56,17.15 18.92,17.15 17.65,18.42 U3.3
A27: length 43
  Bottom Layer w0.254: U3.4 16.38,20.22 16.38,17.15 17.53,16 27.31,16 28.32,14.99 28.32,6.73 29.34,5.72 H3.1
A30: length 7.2
  Top Layer w0.254: R4.1 47.05,16.96 47.05,20 48.13,21.08 U3.28
B00: length 19.8
  Top Layer w0.254: U3.30 49.53,20.35 49.53,13.21 48.64,12.32 R3.1
B04: length 36.6
  Bottom Layer w0.254: U4.7 24.26,56.01 24.26,56.51 24.19,56.58 24.19,57.47 24.26,57.53 24.26,67.95 25.4,69.09 41.91,69.09 42.8,68.2 H6.1
B10: length 14.7
  Top Layer w0.254: U3.32 51.94,20.22 51.94,9.91 50.29,8.25 H3.6
B11: length 18.1
  Top Layer w0.254: U3.34 54.61,20.35 54.61,10.29 H3.5
B15: length 10.3
  Top Layer w0.254: 27.81,57.02 27.81,59.69 28.32,60.2 29.59,60.2 30.86,61.47 CN2.2
B16: length 8.3
  Bottom Layer w0.254: v2(28.32,63.88) 28.32,61.09 28.83,60.58 29.84,60.58 30.35,60.07 30.35,57.02
B19: length 39.8
  Top Layer w0.254: H4.6 34.54,31.75 35.56,30.73 35.56,21.62 U3.18
B20: length 52.2
  Top Layer w0.254: v2(24,42.93) 24,60.33 23.49,60.83 15.49,60.83 14.99,61.34 H1.3
  Bottom Layer w0.254: v2(24,42.93) 24,22.76 U3.10
B21: length 52.2
  Top Layer w0.254: H4.5 44.32,34.29 45.47,33.15 45.47,21.62 U3.26
B22: length 59.1
  Top Layer w0.254: H4.4 45.72,36.83 46.86,35.69 46.86,20.45 45.59,19.18 U3.25
B23: length 63.4
  Top Layer w0.254: H4.3 49.78,39.37 52.07,41.66 52.07,55.88 53.21,57.02
B24: length 54
  Top Layer w0.254: H1.2 v2(12.45,42.67)
  Bottom Layer w0.254: U3.7 22.58,18.95 21.59,19.94 21.59,26.67 20.32,27.94 13.72,27.94 12.45,29.21 v2(12.45,42.67)
B25: length 72.7
  Top Layer w0.254: U3.8 29.46,28.22 v1(29.46,28.32)
  Bottom Layer w0.254: H2.2 57.15,64.77 57.15,45.21 56.01,44.07 30.48,44.07 29.46,43.05 v1(29.46,28.32)
B26: length 15.3
  Top Layer w0.254: U4.31 54.48,55.75 54.48,58.93 55.25,59.69 59.06,59.69 59.56,60.2 H2.3
DC12V:
  vias: v8(86.61,14.1)
$1N263:
  vias: v3(80.05,25.39) v6(76.01,28.19) v7(76.96,32.64) v7(80.14,27.95)
$1N264: length 2.8
  Top Layer w0.762: C1.1 74.61,28.19 74.61,25.39 74.61,25.39
$1N267: length 0.2
  Top Layer w0.254: v2(80.05,24.12) 80.19,24.26
  vias: v7(86.49,29.72) v7(86.55,24) v7(86.74,18.92) v8(82.04,24.07)
$1N278: length 5.5
  Top Layer w0.508: R2.1 71.37,21.73 R1.2
  Top Layer w0.602: U1.4 71.37,21.58
$1N286: length 2.9
  Top Layer w0.254: R3.2 34.41,12.32 LED1.2
$1N289: length 20.5
  Top Layer w0.254: 27.44,10.61 27.5,10.67 30.61,10.67 31.12,11.18 31.12,14.6 31.88,15.37 R4.2
$1N292: length 6
  Top Layer w0.254: BUZ1.2 21.34,11.05 21.84,11.56 25.14,11.56

## Copper pours and planes (outline as drawn; the poured copper is in the pictures)
GND on Top Layer: -1.14,77.22 95.88,77.22 95.88,-0.76 -1.14,-0.76
GND on Bottom Layer: 49.4,74.93 56.05,72.18 58.8,65.53 58.8,18.03 57.87,15.79 52.66,13.63 51.44,10.67 51.44,2.97 50.49,0.69 48.21,-0.25 2.54,-0.25 0.56,0.56 -0.25,2.54 -0.25,72.01 0.6,74.07 2.67,74.93
PGND on Inner1: 76.85,5.45 78.1,6.71 79.36,5.45 79.36,4.45 78.1,3.2 76.85,4.45
PGND on Inner1: 72.15,5.45 73.41,6.71 74.66,5.45 74.66,4.45 73.41,3.2 72.15,4.45
PGND on Inner1: 89.93,67.24 86.68,70.5 89.93,73.76 93.19,70.5
PGND on Inner1: 89.7,2.22 86.45,5.47 89.7,8.73 92.96,5.47
PGND on Inner1: 58.12,2.33 55.12,5.33 58.12,8.34 61.13,5.33
PGND on Inner1: 84.06,4.45 82.81,3.2 81.55,4.45 81.55,5.45 82.81,6.71 84.06,5.45
PGND on Inner1: 65.32,2.33 62.32,5.33 65.32,8.34 68.33,5.33
PGND on Inner1: 61.21,31.88 61.21,31.89 61.21,31.89 61.21,31.88
PGND on Inner1: -0.89,77.09 96.39,77.09 96.39,-0.51 -0.89,-0.51
VCC_5 on Inner2: 67.5,42.03 68.51,44.46 70.94,45.47 79.88,45.47 81.41,44.83 82.04,43.31 79.38,39.62 75.69,36.96 75.2,36.46 73.67,32.79 71.84,29.25 71.88,28.83 70.86,29.26 70.74,30.35 68.45,31.3 67.5,33.59
VCC_5 on Inner2: 71.87,53.86 71.88,53.81 71.88,53.76
DC12V on Inner2: 81.03,10.92 82.55,14.6 86.23,16.13 89.29,14.86 90.55,11.81 90.55,11.43 89.92,9.9 88.39,9.27 87.05,8.25 86.03,6.9 85.85,2.29 85.52,1.48 84.71,1.14 83.06,1.14 81.62,1.74 81.03,3.18
$1N263 on Inner2: 75.31,33.8 75.81,35.01 77.02,35.51 77.91,35.51 78.57,35.24 78.85,34.58 78.85,31.9 79.08,31.34 79.63,31.12 80.52,31.12 81.69,30.63 82.17,29.46 82.17,25.91 81.83,25.1 81.03,24.77 79.42,24.77 79.02,24.93 78.85,25.33 78.85,25.41 78.6,26.03 77.98,26.29 76.07,26.29 75.53,26.51 75.31,27.05
$1N267 on Inner2: 79.31,23.33 79.07,23.43 78.97,23.66 78.97,23.98 79.17,24.45 79.63,24.64 82.78,24.79 83.23,25.73 83.69,26.67 83.94,28.02 84.33,30.23 86.27,31.37 87.34,31.37 88.47,30.34 88.84,28.86 88.84,18.73 88.26,17.34 86.87,16.76 84.92,17.57 84.11,19.52 84.11,22.29 83.84,22.72 83.41,22.99
$1N298 on Inner2: 63.63,1.14 62.37,1.66 61.85,2.92 61.85,6.22 62.75,10.05 65.53,12.83 76.84,12.83 79.43,10.13 80.26,6.48 80.26,3.68 79.82,2.61 78.74,2.16 78.49,2.16 76.69,2.9 75.95,4.7 75.95,6.6 75.5,7.68 74.42,8.13 72.52,8.13 70.81,7.42 70.1,5.72 70.1,2.79 69.62,1.63 68.45,1.14
VCC_5 on Inner2: 72.37,22.58 68.3,19.3 63.67,16.91 64.12,17.36 64.16,20.75 64.39,24.13 63.87,27.65 65.41,30.86 65.41,34.16 65.63,34.16 66.17,34.39 66.4,34.93 66.4,35.66 67.18,37.57 69.09,38.35 71.96,37.16 73.15,34.29 73.15,23.24 72.96,22.77 72.49,22.58
VCC_5 on Inner2: 67.18,59.18 69.41,56.66 70.95,53.67 72.14,40.27 68.92,40.27 68.12,40.6 67.79,41.4 67.56,38.35 66.34,42.1 64.52,45.59 63.48,47.59 62.91,49.77 61.85,56.13 62.99,58.42 65.44,59.18
VCC_5 on Inner2: 66.8,68.45 68.95,65.51 69.86,61.98 70.69,54.23 61.98,54.23 61.98,60.71 61.74,61.7 60.96,62.36 27.69,62.36 24.54,63.97 24.31,67.49 26.51,68.37 28.83,68.83
VCC_5 on Inner2: 59.56,28.88 60.14,30.28 61.54,30.86 66.04,30.86 66.94,30.49 67.31,29.59 68.03,29.29 68.33,28.58 68.33,28.32 67.94,28.32 66.06,27.54 65.28,25.65 65.28,18.29 64.76,17.03 63.5,16.51 60.72,17.66 59.56,20.45

Small or netless copper shapes (teardrops, artwork), in the pictures only: 63 on Top Layer, 18 on Bottom Layer, 2 on Inner1, 2 on Inner2

## Text on the board
Top Silkscreen Layer: GND | 3V3 | SCL | SDA | LED | 10K | A26 | A27 | B10 | B11 | 330U | 100N | 3.16K | 10U | 10N | 15U | 4.7U | B24 | B20 | B04 | 5V | B25 | B26 | B23 | B22 | B21 | B19 | NC | OLED | 蜂鸣器 | 编码器2 | 舵机 | 编码器1
